# EAGLE schematic Coordinator (EAGLE 9.6.2)
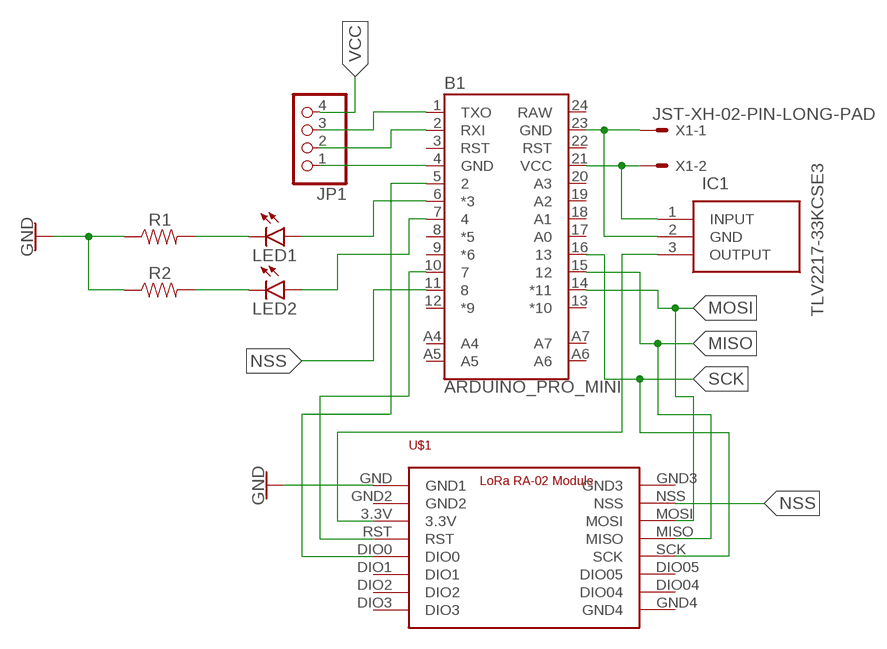
[diagram p0: schematic, sheet 1]

## Parts
B1  ARDUINO_PRO_MINI  [ARDUINO_PRO_MINI]
IC1  TLV2217-33KCSE3  [TO254P470X1016X1965-3P]
JP1  PINHD-1X4  [1X04]
LED1  LEDCHIPLED_0805  [CHIPLED_0805]
LED2  LEDCHIPLED_0805  [CHIPLED_0805]
R1  RESISTOR0805  [0805]
R2  RESISTOR0805  [0805]
U$1  LORA_RA-02_MODULE  [LORA_RA-02_MODULE_FOOTPRINT]
X1  JST-XH-02-PIN-LONG-PAD  [JST-XH-02-PACKAGE-LONG-PAD]

## Nets
GND: R1.1 R2.1 U$1.GND(GND1)
MISO: B1.15 U$1.MISO
MOSI: B1.14(*11) U$1.MOSI
N$1: B1.23(GND) IC1.2(GND) X1.1
N$2: B1.21(VCC) IC1.1(INPUT) X1.2
N$3: IC1.3(OUTPUT) U$1.3.3V
N$4: B1.4(GND) JP1.1
N$5: B1.2(RXI) JP1.2
N$6: B1.1(TXO) JP1.3
N$7: B1.5 U$1.DIO0
N$8: B1.10 U$1.RST
N$9: B1.6(*3) LED1.A
N$10: B1.7 LED2.A
N$11: LED1.C R1.2
N$12: LED2.C R2.2
NSS: B1.11 U$1.NSS
SCK: B1.16 U$1.SCK
VCC: JP1.4
Unconnected: B1.3(RST) B1.8(*5) B1.9(*6) B1.12(*9) B1.13(*10) B1.17(A0) B1.18(A1) B1.19(A2) B1.20(A3) B1.22(RST) B1.A4 B1.A5 B1.A6 B1.A7 U$1.DIO1 U$1.DIO2 U$1.DIO3 U$1.DIO04 U$1.DIO05 U$1.GND2 U$1.GND3 U$1.GND4

## Power pins joined to a net without a drawn wire
RAW: B1.24(RAW)

## Library data of the parts
B1 = SparkFun-Boards:ARDUINO_PRO_MINI: SparkFun Pro Mini Pro Mini compatible footprint. Dimensions: 0.7 x 1.3" PCB Thickness: 0.8mm SparkFun Products: 3.3V/8MHz <https://www.sparkfun.com/products/11114> 5V/16MHz <https://www.sparkfun.com/products/11113>
IC1 = TLV2217-33KCSE3:TLV2217-33KCSE3: Low-Dropout Fixed-Voltage Regulators Source: Datasheet <http://www.ti.com/lit/gpn/tlv2217>; ARROW_PART_NUMBER: TLV2217-33KCSE3; ARROW_PRICE-STOCK: https://www.arrow.com/en/products/tlv2217-33kcse3/texas-instruments; DESCRIPTION: Low-Dropout Fixed-Voltage Regulators; HEIGHT: 4.7mm; MANUFACTURER_NAME: Texas Instruments; MANUFACTURER_PART_NUMBER: TLV2217-33KCSE3; MOUSER_PART_NUMBER: 595-TLV2217-33KCSE3; MOUSER_PRICE-STOCK: https://www.mouser.co.uk/ProductDetail/Texas-Instruments/TLV2217-33KCSE3?qs=LVErsypW30y56XyeRJBjlA%3D%3D
JP1 = pinhead:PINHD-1X4: PIN HEADER
LED1 LED2 = led:LED: LED OSRAM: - CHIPLED LG R971, LG N971, LY N971, LG Q971, LY Q971, LO R971, LY R971 LH N974, LH R974 LS Q976, LO Q976, LY Q976 LO Q996 - Hyper CHIPLED LW Q18S LB Q993, LB Q99A, LB R99A - SideLED LS A670, LO A670, LY A670, LG A670, LP A670 LB A673, LV A673, LT A673, LW A673 LH A674 LY A675 LS A676, LA A676, LO A676, LY A676, LW A676 LS A679, LY A679, LG A679 - Hyper Micro SIDELED® LS Y876, LA Y876, LO Y876, LY Y876 LT Y87S - SmartLED LW L88C, LW L88S LB L89C, LB L89S, LG L890 LS L89K, LO L89K, LY L89K LS L896, LA L896, LO L896, LY L896 - TOPLED LS T670, LO T670, LY T670, LG T670, LP T670 LSG T670, LSP T670, LSY T670, LOP T670, LYG T670 LG T671, LOG T671, LSG T671 LB T673, LV T673, LT T673, LW T673 LH T674 LS T676, LA T676, LO T676, LY T676, LB T676, LH T676, LSB T676, LW T676 LB T67C, LV T67C, LT T67C, LS T67K, LO T67K, LY T67K, LW E67C LS E67B, LA E67B, LO E67B, LY E67B, LB E67C, LV E67C, LT E67C LW T67C LS T679, LY T679, LG T679 LS T770, LO T770, LY T770, LG T770, LP T770 LB T773, LV T773, LT T773, LW T773 LH T774 LS E675, LA E675, LY E675, LS T675 LS T776, LA T776, LO T776, LY T776, LB T776 LHGB T686 LT T68C, LB T68C - Hyper Mini TOPLED® LB M676 - Mini TOPLED Santana® LG M470 LS M47K, LO M47K, LY M47K Source: http://www.osram.convergy.de LUXEON: - LUMILED® LXK2-PW12-R00, LXK2-PW12-S00, LXK2-PW14-U00, LXK2-PW14-V00 LXK2-PM12-R00, LXK2-PM12-S00, LXK2-PM14-U00 LXK2-PE12-Q00, LXK2-PE12-R00, LXK2-PE12-S00, LXK2-PE14-T00, LXK2-PE14-U00 LXK2-PB12-K00, LXK2-PB12-L00, LXK2-PB12-M00, LXK2-PB14-N00, LXK2-PB14-P00, LXK2-PB14-Q00 LXK2-PR12-L00, LXK2-PR12-M00, LXK2-PR14-Q00, LXK2-PR14-R00 LXK2-PD12-Q00, LXK2-PD12-R00, LXK2-PD12-S00 LXK2-PH12-R00, LXK2-PH12-S00 LXK2-PL12-P00, LXK2-PL12-Q00, LXK2-PL12-R00 Source: www.luxeon.com KINGBRIGHT: KA-3528ASYC Source: www.kingbright.com
R1 R2 = SparkFun-Resistors:RESISTOR: Generic Resistor Package
U$1 = LORA_RA-02_MODULE:LORA_RA-02_MODULE: LoRa Ra-02 module for pin socket.
X1 = Rembrandt Electronics - JST XH Connectors v1-0:JST-XH-02-PIN: JST XH Connector 2 Pin Wire to board connector. Pitch: 2,54 mm, (0.100") Number of pins: 2 Created by Rembrandt Electronics www.rembrandtelectronics.com